# Altium schematic sheet Moto Power Supply 4x12v 4x5v (v2.0).SchDoc: ComponentName
size A4; SheetNumber: 1; SheetTotal: 1; Version: ver; Variant: Variant; Modification: Mod; Project: Project Name
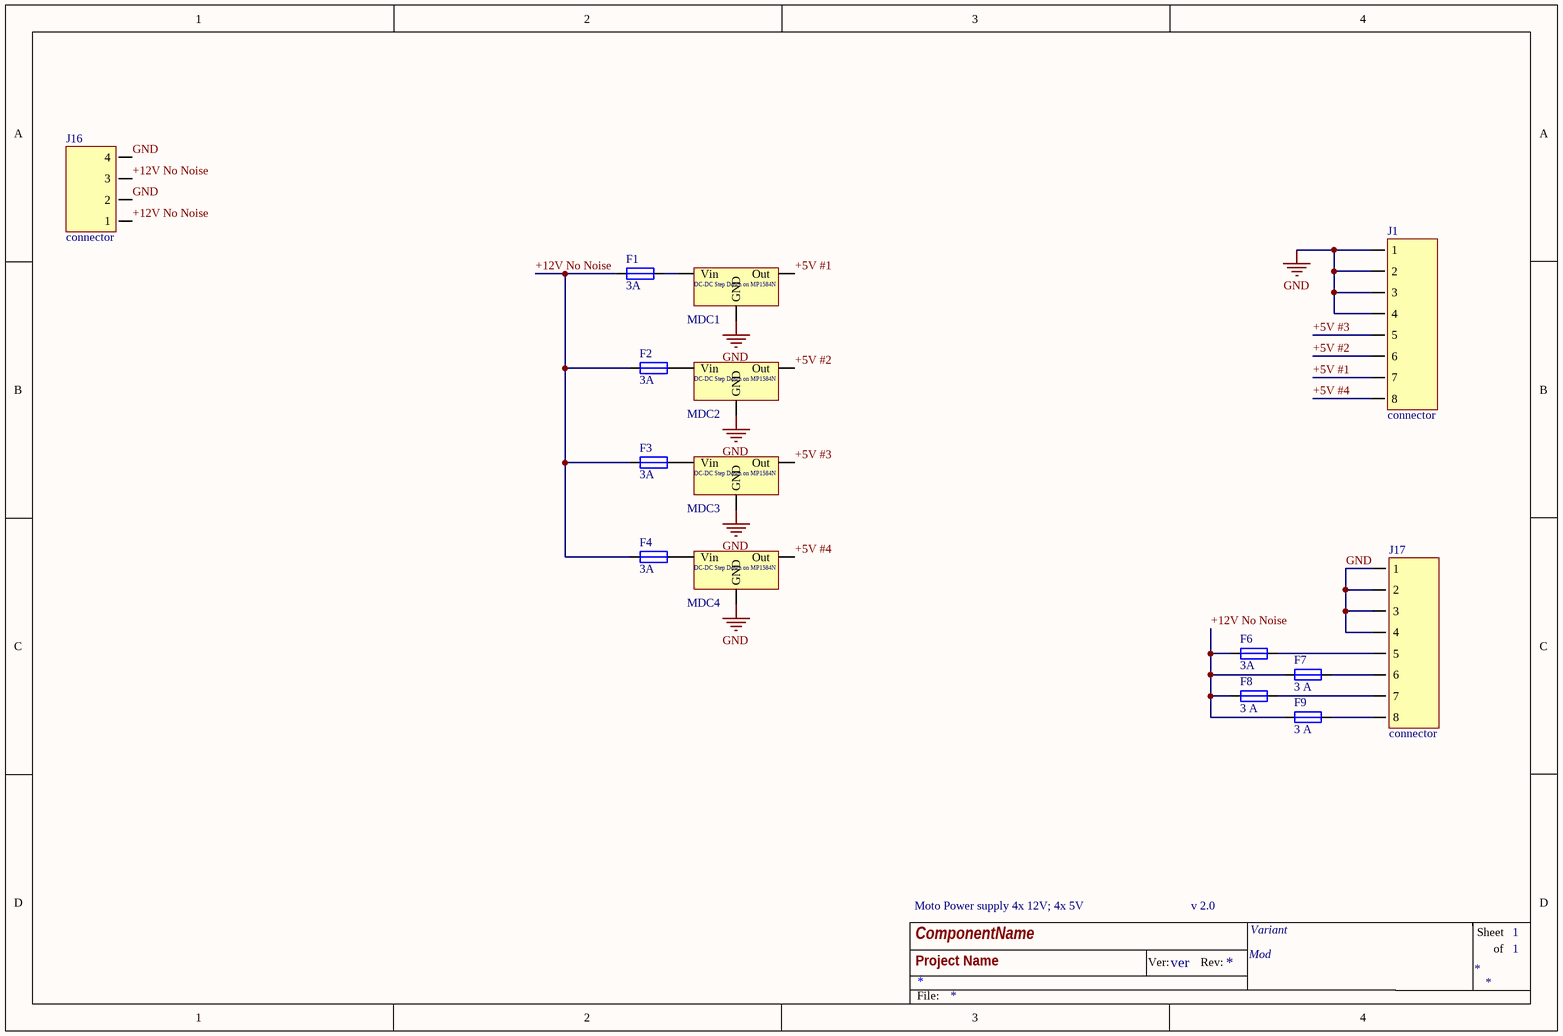
[diagram p0: Moto Power Supply 4x12v 4x5v (v2.0).SchDoc]

## Parts
F1  3A  [Fuse MF-R300 (3A)]
F2  3A  [Fuse MF-R300 (3A)]
F3  3A  [Fuse MF-R300 (3A)]
F4  3A  [Fuse MF-R300 (3A)]
F6  3A  [Fuse MF-R300 (3A)]
F7  3 A  [Fuse MF-R300 (3A)]
F8  3 A  [Fuse MF-R300 (3A)]
F9  3 A  [Fuse MF-R300 (3A)]
J1  connector  [Molex Mini-Fit Jr - 8Pin V]
J16  connector  [Molex Mini-Fit Jr - 4Pin V]
J17  connector  [Molex Mini-Fit Jr - 8Pin V]
MDC1  DC-DC  [DC-DC_MP1584N (SMALL)]  (value not drawn)
MDC2  DC-DC  [DC-DC_MP1584N (SMALL)]  (value not drawn)
MDC3  DC-DC  [DC-DC_MP1584N (SMALL)]  (value not drawn)
MDC4  DC-DC  [DC-DC_MP1584N (SMALL)]  (value not drawn)

## Nets
GND: J1.1 J1.2 J1.3 J1.4 J16.2 J16.4 J17.1 J17.2 J17.3 J17.4 MDC1.GND MDC2.GND MDC3.GND MDC4.GND
+5V #1: J1.7 MDC1.OUT(Out)
+5V #2: J1.6 MDC2.OUT(Out)
+5V #3: J1.5 MDC3.OUT(Out)
+5V #4: J1.8 MDC4.OUT(Out)
+12V No Noise: F1.2 F2.2 F3.2 F4.2 F6.2 F7.2 F8.2 F9.2 J16.1 J16.3
NetF1_1: F1.1 MDC1.IN(Vin)
NetF2_1: F2.1 MDC2.IN(Vin)
NetF3_1: F3.1 MDC3.IN(Vin)
NetF4_1: F4.1 MDC4.IN(Vin)
NetF6_1: F6.1 J17.5
NetF7_1: F7.1 J17.6
NetF8_1: F8.1 J17.7
NetF9_1: F9.1 J17.8

## Notes on the sheet
- Moto Power supply 4x 12V; 4x 5V
- v 2.0
- Ver:
- Rev:
- Sheet
- of
- File:
- (in symbol DC-DC MP1584N) DC-DC Step Down on MP1584N

## Library data of the parts
F1-F4 F6-F9 = Fuse: Round fuse
J1 J17 = Molex Mini-Fit Jr - 8 pin: Right, Dbl line, Female
J16 = Molex Mini-Fit Jr - 4 pin: Right, Dbl line, Female
MDC1-MDC4 = DC-DC MP1584N: DC-DC StepDown